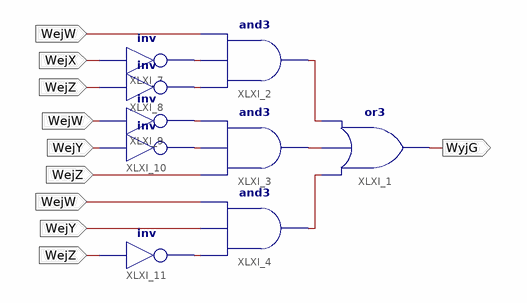
[diagram p0: schematic sheet 1]
// Xilinx ISE schematic schematic_zad2.sch (xc9500xl) as structural Verilog: 9 symbols, 5 ports
module schematic_zad2 (
  input  WejW,
  input  WejZ,
  input  WejY,
  input  WejX,
  output WyjG
);

  wire XLXN_1, XLXN_2, XLXN_3, XLXN_4, XLXN_5, XLXN_6, XLXN_7, XLXN_8;

  or XLXI_1 (WyjG, XLXN_3, XLXN_2, XLXN_1);
  and XLXI_3 (XLXN_2, WejZ, XLXN_7, XLXN_6);
  and XLXI_4 (XLXN_3, XLXN_8, WejY, WejW);
  not XLXI_11 (XLXN_8, WejZ);
  not XLXI_9 (XLXN_6, WejW);
  not XLXI_10 (XLXN_7, WejY);
  and XLXI_2 (XLXN_1, XLXN_5, XLXN_4, WejW);
  not XLXI_7 (XLXN_4, WejX);
  not XLXI_8 (XLXN_5, WejZ);
endmodule
